# Altium project IRIS2_PCB_CPU.PrjPcb
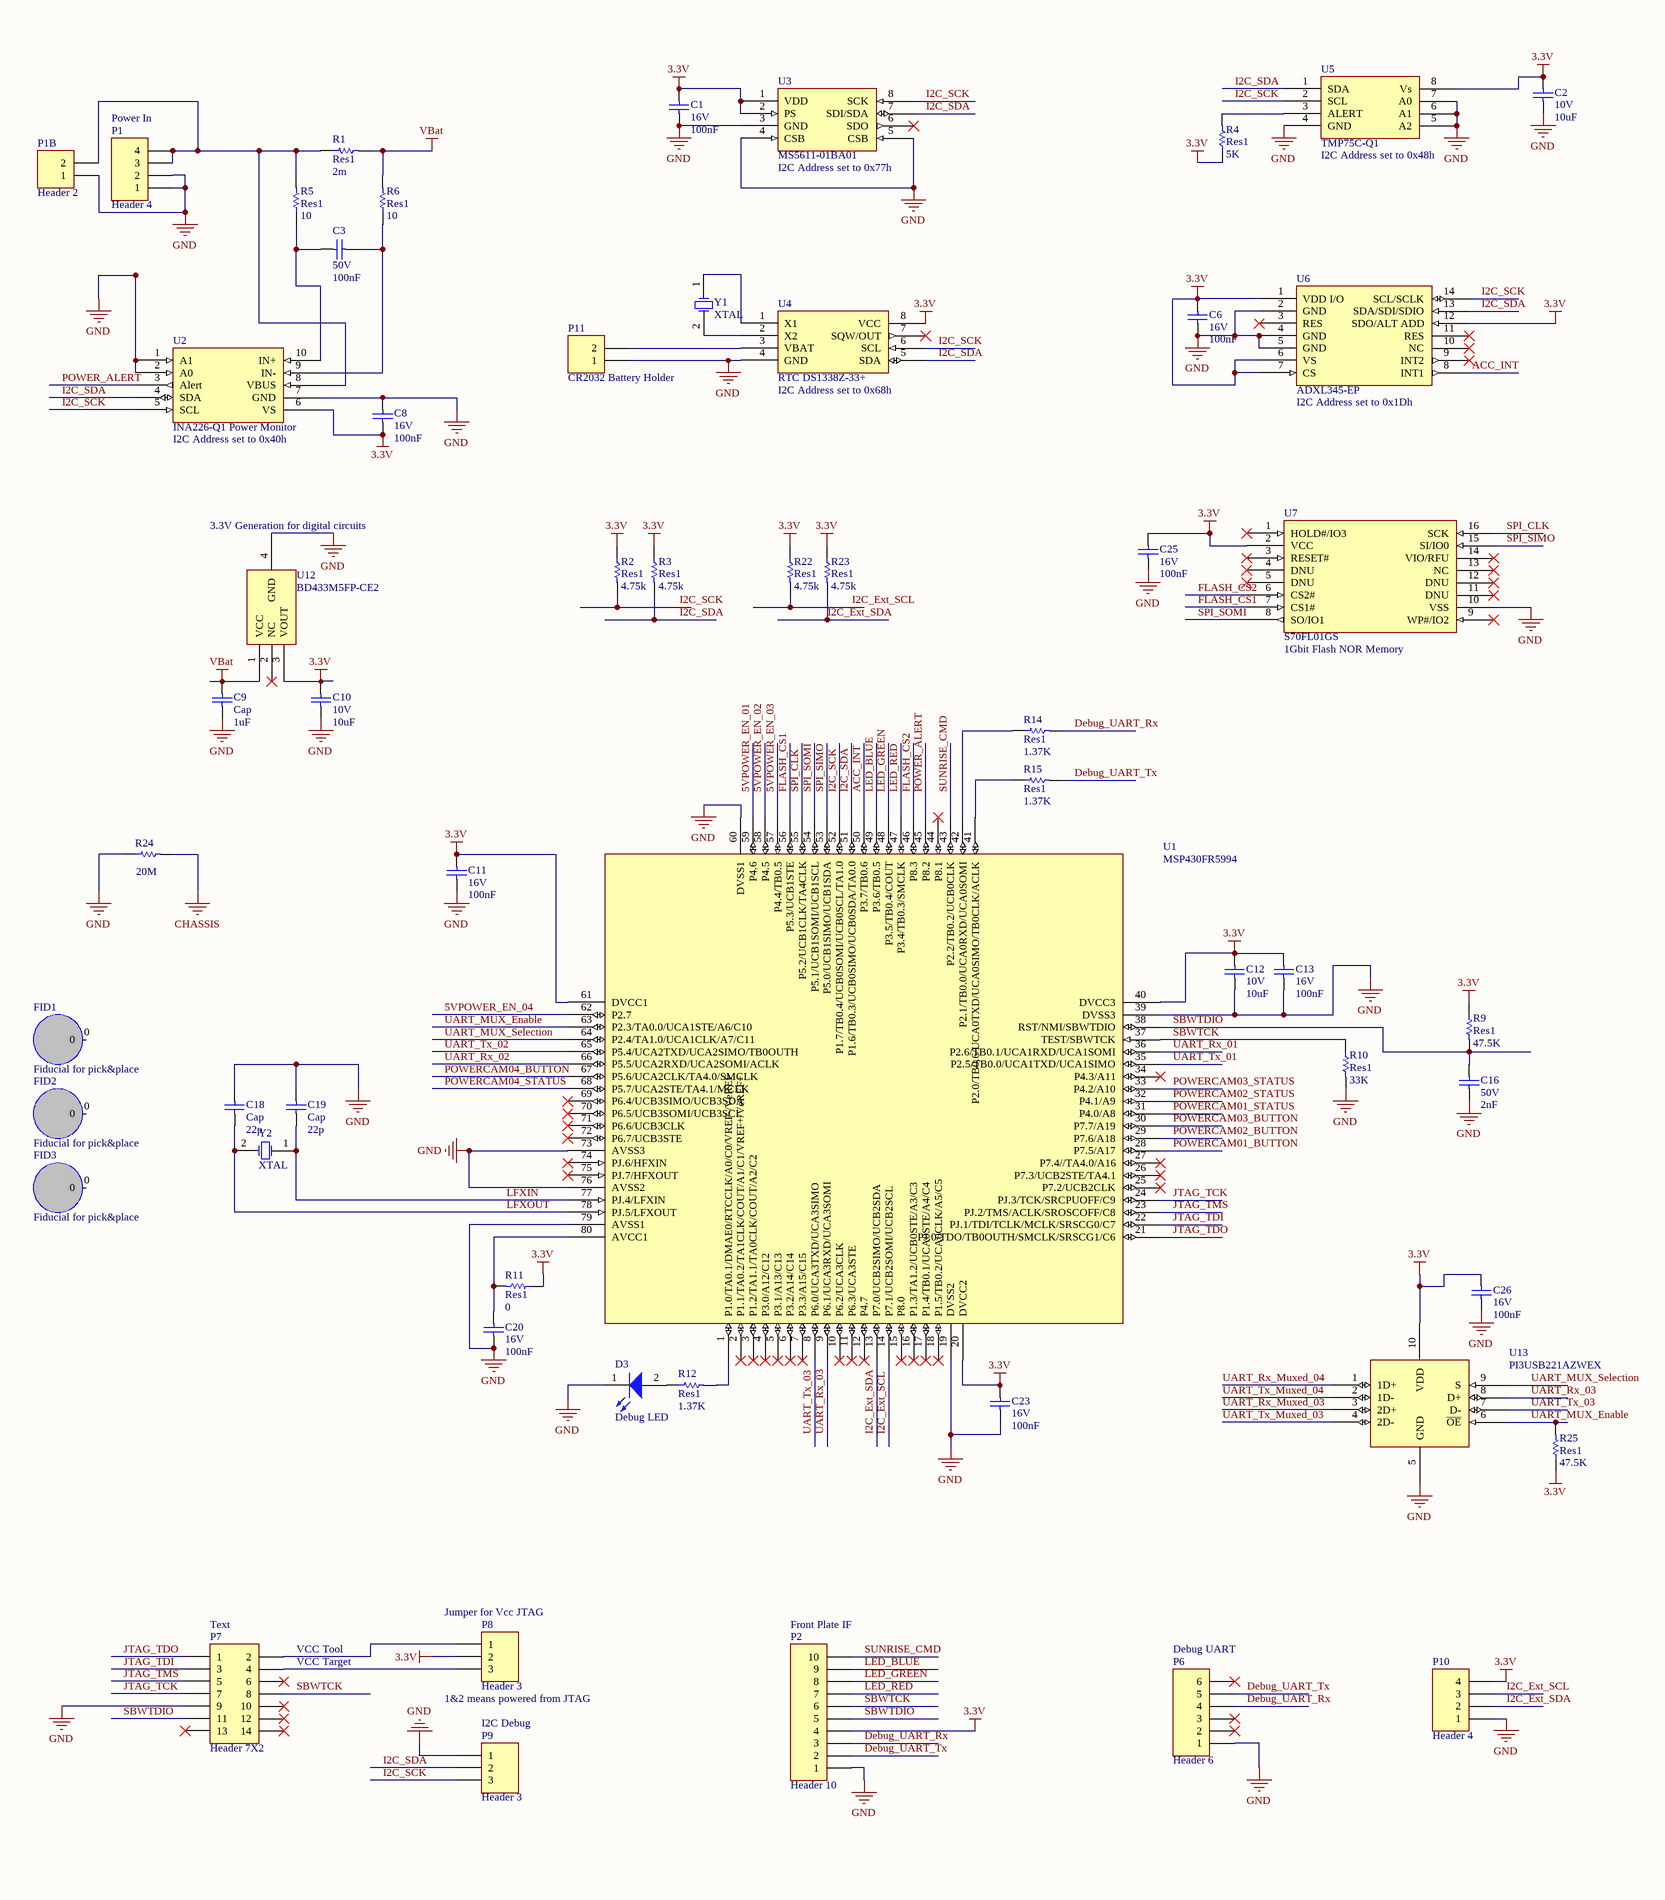
[diagram p0: IRIS2_PCB_CPU.SchDoc, left]
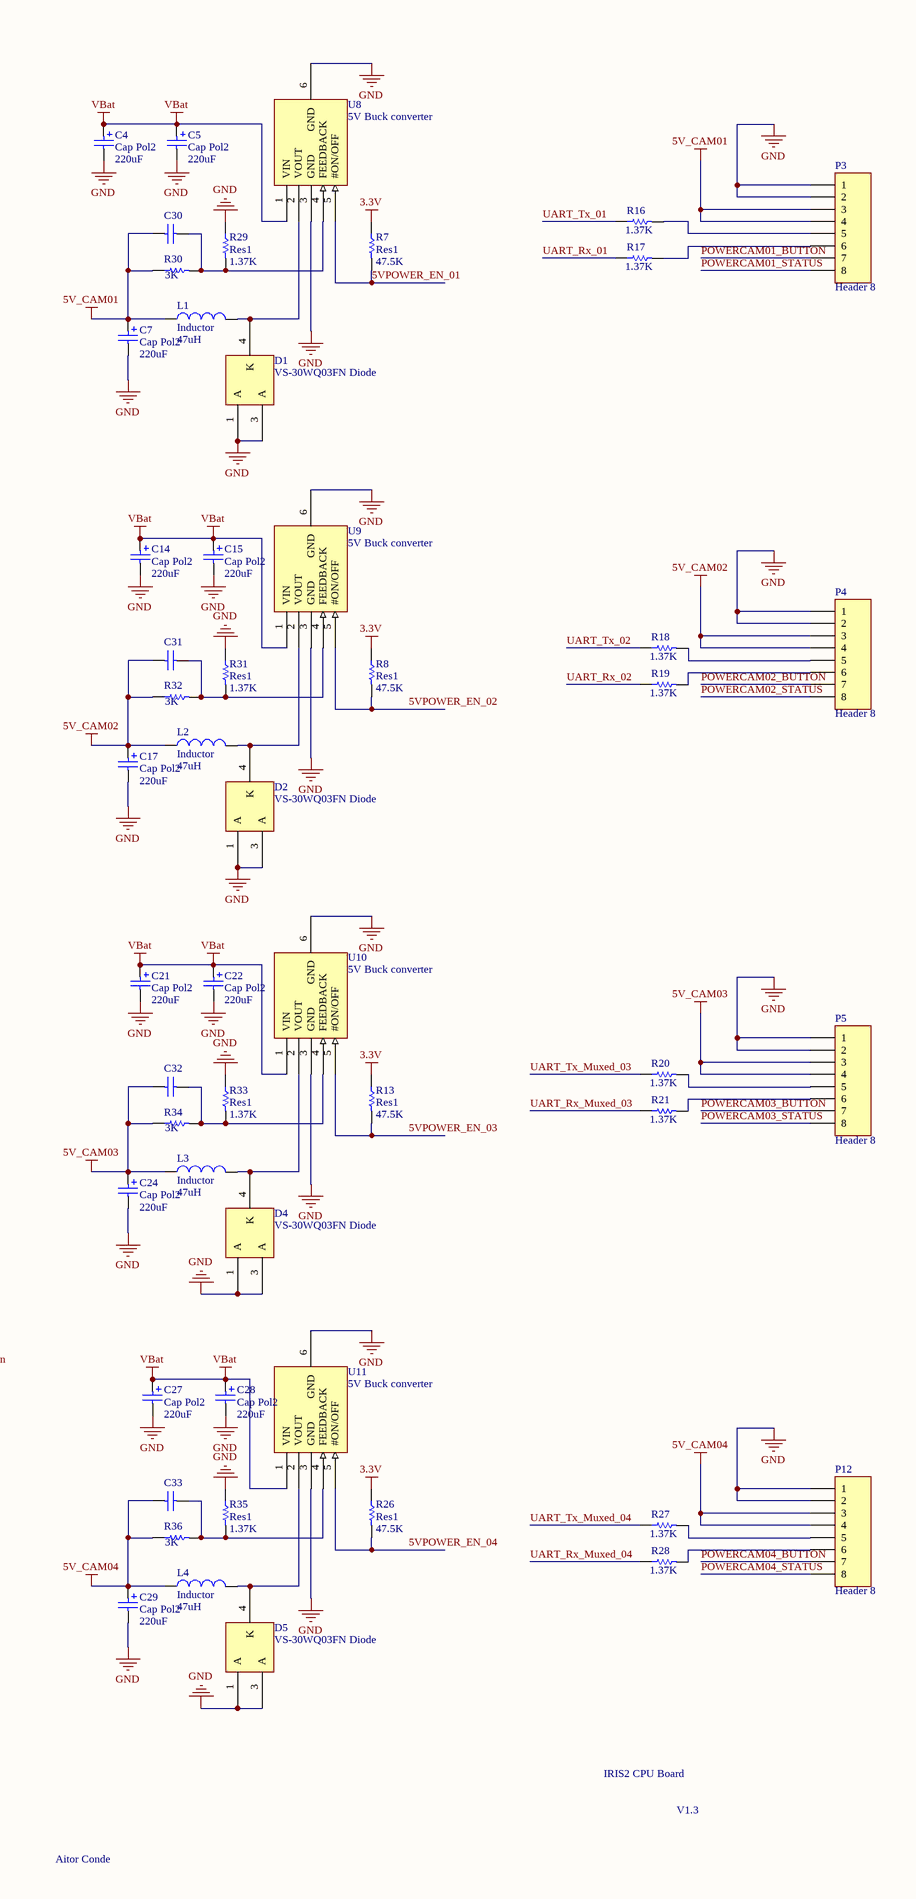
[diagram p1: IRIS2_PCB_CPU.SchDoc, right]
1 sheet, 109 parts. Net scope: global (net labels, ports and power ports of the same name join across sheets).
Board file: IRIS2_PCB_CPU.PcbDoc

## Sheet IRIS2_PCB_CPU.SchDoc
size A2; SheetNumber: 1; SheetTotal: 1

### Parts
C1  16V  value 100nF  [0402]
C2  10V  value 10uF  [1608[0603]]
C3  50V  value 100nF  [6-0805_L]
C4  Cap Pol2  value 220uF  [2917 [7343 Metric]]
C5  Cap Pol2  value 220uF  [2917 [7343 Metric]]
C6  16V  value 100nF  [0402]
C7  Cap Pol2  value 220uF  [2917 [7343 Metric]]
C8  16V  value 100nF  [0402]
C9  Cap  value 1uF  [1608[0603]]
C10  10V  value 10uF  [1608[0603]]
C11  16V  value 100nF  [0402]
C12  10V  value 10uF  [1608[0603]]
C13  16V  value 100nF  [0402]
C14  Cap Pol2  value 220uF  [2917 [7343 Metric]]
C15  Cap Pol2  value 220uF  [2917 [7343 Metric]]
C16  50V  value 2nF  [0402]
C17  Cap Pol2  value 220uF  [2917 [7343 Metric]]
C18  Cap  value 22p  [0402]
C19  Cap  value 22p  [0402]
C20  16V  value 100nF  [0402]
C21  Cap Pol2  value 220uF  [2917 [7343 Metric]]
C22  Cap Pol2  value 220uF  [2917 [7343 Metric]]
C23  16V  value 100nF  [0402]
C24  Cap Pol2  value 220uF  [2917 [7343 Metric]]
C25  16V  value 100nF  [0402]
C26  16V  value 100nF  [0402]
C27  Cap Pol2  value 220uF  [2917 [7343 Metric]]
C28  Cap Pol2  value 220uF  [2917 [7343 Metric]]
C29  Cap Pol2  value 220uF  [2917 [7343 Metric]]
C30  16V  [0402]  (value not drawn)
C31  16V  [0402]  (value not drawn)
C32  16V  [0402]  (value not drawn)
C33  16V  [0402]  (value not drawn)
D1  VS-30WQ03FN Diode  [VS-30WQ03FN]
D2  VS-30WQ03FN Diode  [VS-30WQ03FN]
D3  Debug LED  [0402-A]
D4  VS-30WQ03FN Diode  [VS-30WQ03FN]
D5  VS-30WQ03FN Diode  [VS-30WQ03FN]
FID1  Fiducial for pick&place  [FiducialPoint]
FID2  Fiducial for pick&place  [FiducialPoint]
FID3  Fiducial for pick&place  [FiducialPoint]
L1  Inductor  value 47uH  [DO5022P-473MLB]
L2  Inductor  value 47uH  [DO5022P-473MLB]
L3  Inductor  value 47uH  [DO5022P-473MLB]
L4  Inductor  value 47uH  [DO5022P-473MLB]
P1  Header 4  [53047-0410]
P1B  Header 2  [HDR1X2]
P2  Header 10  [530471010]
P3  Header 8  [0530470810]
P4  Header 8  [0530470810]
P5  Header 8  [0530470810]
P6  Header 6  [HDR1X6]
P7  Header 7X2  [HDR2X7]
P8  Header 3  [HDR1X3]
P9  Header 3  [HDR1X3]
P10  Header 4  [53047-0410]
P11  CR2032 Battery Holder  [SMTU2032-LF]
P12  Header 8  [0530470810]
R1  Res1  value 2m  [INDC3216]
R2  Res1  value 4.75k  [0402]
R3  Res1  value 4.75k  [0402]
R4  Res1  value 5K  [0402]
R5  Res1  value 10  [0402]
R6  Res1  value 10  [0402]
R7  Res1  value 47.5K  [0402]
R8  Res1  value 47.5K  [0402]
R9  Res1  value 47.5K  [0402]
R10  Res1  value 33K  [0402]
R11  Res1  value 0  [J1-0603]
R12  Res1  value 1.37K  [0402]
R13  Res1  value 47.5K  [0402]
R14  Res1  value 1.37K  [0402]
R15  Res1  value 1.37K  [0402]
R16  value 1.37K  [0402]  (hidden comment: Res1)
R17  value 1.37K  [0402]  (hidden comment: Res1)
R18  value 1.37K  [0402]  (hidden comment: Res1)
R19  value 1.37K  [0402]  (hidden comment: Res1)
R20  value 1.37K  [0402]  (hidden comment: Res1)
R21  value 1.37K  [0402]  (hidden comment: Res1)
R22  Res1  value 4.75k  [0402]
R23  Res1  value 4.75k  [0402]
R24  value 20M  [6-0805_N]  (hidden comment: Res1)
R25  Res1  value 47.5K  [0402]
R26  Res1  value 47.5K  [0402]
R27  value 1.37K  [0402]  (hidden comment: Res1)
R28  value 1.37K  [0402]  (hidden comment: Res1)
R29  Res1  value 1.37K  [0402]
R30  value 3K  [0402]  (hidden comment: Res1)
R31  Res1  value 1.37K  [0402]
R32  value 3K  [0402]  (hidden comment: Res1)
R33  Res1  value 1.37K  [0402]
R34  value 3K  [0402]  (hidden comment: Res1)
R35  Res1  value 1.37K  [0402]
R36  value 3K  [0402]  (hidden comment: Res1)
U1  MSP430FR5994  [MSP430FR59941PN]
U2  INA226-Q1 Power Monitor  [INA226-Q1]
U3  MS5611-01BA01  [MS5611-01BA01]
U4  RTC DS1338Z-33+  [DS1338Z-33+]
U5  TMP75C-Q1  [TMP75C-Q1]
U6  ADXL345-EP  [ADXL345-EP]
U7  S70FL01GS  [SPIFlash_S70FL01GSAGMFV010]
U8  5V Buck converter  [DPAK170P1435X457-6N]
U9  5V Buck converter  [DPAK170P1435X457-6N]
U10  5V Buck converter  [DPAK170P1435X457-6N]
U11  5V Buck converter  [DPAK170P1435X457-6N]
U12  BD433M5FP-CE2  [BD433M5FP-CE2]
U13  PI3USB221AZWEX  [PI3USB221AZWEX]
Y1  XTAL  [XTAL_ECS-.327-9-34R-TR]
Y2  XTAL  [XTAL_ECS-.327-9-34R-TR]

### Nets
3.3V: C1.1 C2.1 C6.1 C8.2 C10.1 C11.1 C12.1 C13.1 C23.1 C25.1 C26.1 P2.4 P8.2 P10.4 R2.1 R3.1 R4.1 R7.1 R8.1 R9.1 R11.1 R13.1 R22.1 R23.1 R25.1 R26.1 U1.20(DVCC2) U1.40(DVCC3) U1.61(DVCC1) U2.6(VS) U3.1(VDD) U3.2(PS) U4.8(VCC) U5.8(Vs) U6.1(VDD_I/O) U6.6(VS) U6.7(CS) U6.12(SDO/ALT_ADD) U7.2(VCC) U12.3(VOUT) U13.10(VDD)
5V_CAM01: C7.1 C30.1 L1.1 P3.3 P3.4 R30.1
5V_CAM02: C17.1 C31.1 L2.1 P4.3 P4.4 R32.1
5V_CAM03: C24.1 C32.1 L3.1 P5.3 P5.4 R34.1
5V_CAM04: C29.1 C33.1 L4.1 P12.3 P12.4 R36.1
CHASSIS: R24.2
GND: C1.2 C2.2 C4.2 C5.2 C6.2 C7.2 C8.1 C9.1 C10.2 C11.2 C12.2 C13.2 C14.2 C15.2 C16.2 C17.2 C18.2 C19.2 C20.2 C21.2 C22.2 C23.2 C24.2 C25.2 C26.2 C27.2 C28.2 C29.2 D1.1(A) D1.3(A) D2.1(A) D2.3(A) D3.1(K) D4.1(A) D4.3(A) D5.1(A) D5.3(A) P1.1 P1.2 P1B.1 P2.1 P3.1 P3.2 P4.1 P4.2 P5.1 P5.2 P6.1 P7.9 P9.1 P10.1 P11.1 P12.1 P12.2 R10.2 R24.1 R29.1 R31.1 R33.1 R35.1 U1.19(DVSS2) U1.39(DVSS3) U1.60(DVSS1) U1.73(AVSS3) U1.76(AVSS2) U1.79(AVSS1) U2.1(A1) U2.2(A0) U2.7(GND) U3.3(GND) U3.4(CSB) U3.5(CSB) U4.4(GND) U5.4(GND) U5.5(A2) U5.6(A1) U5.7(A0) U6.2(GND) U6.4(GND) U6.5(GND) U7.10(VSS) U8.3(GND) U8.6(GND) U9.3(GND) U9.6(GND) U10.3(GND) U10.6(GND) U11.3(GND) U11.6(GND) U12.4(GND) U13.5(GND)
VBat: C4.1 C5.1 C9.2 C14.1 C15.1 C21.1 C22.1 C27.1 C28.1 R1.2 R6.2 U8.1(VIN) U9.1(VIN) U10.1(VIN) U11.1(VIN) U12.1(VCC)
5VPOWER_EN_01: R7.2 U1.59(P4.6) U8.5(#ON/OFF)
5VPOWER_EN_02: R8.2 U1.58(P4.5) U9.5(#ON/OFF)
5VPOWER_EN_03: R13.2 U1.57(P4.4/TB0.5) U10.5(#ON/OFF)
5VPOWER_EN_04: R26.2 U1.62(P2.7) U11.5(#ON/OFF)
ACC_INT: U1.50(P3.7/TB0.6) U6.8(INT1)
Debug_UART_Rx: P2.3 P6.4 R14.2
Debug_UART_Tx: P2.2 P6.5 R15.2
FLASH_CS1: U1.56(P5.3/UCB1STE) U7.7(CS1#)
FLASH_CS2: U1.46(P8.3) U7.6(CS2#)
I2C_Ext_SCL: P10.3 R22.2 U1.14(P7.1/UCB2SOMI/UCB2SCL)
I2C_Ext_SDA: P10.2 R23.2 U1.13(P7.0/UCB2SIMO/UCB2SDA)
I2C_SCK: P9.3 R2.2 U1.52(P1.7/TB0.4/UCB0SOMI/UCB0SCL/TA1.0) U2.5(SCL) U3.8(SCK) U4.6(SCL) U5.2(SCL) U6.14(SCL/SCLK)
I2C_SDA: P9.2 R3.2 U1.51(P1.6/TB0.3/UCB0SIMO/UCB0SDA/TA0.0) U2.4(SDA) U3.7(SDI/SDA) U4.5(SDA) U5.1(SDA) U6.13(SDA/SDI/SDIO)
JTAG_TCK: P7.7 U1.24(PJ.3/TCK/SRCPUOFF/C9)
JTAG_TDI: P7.3 U1.22(PJ.1/TDI/TCLK/MCLK/SRSCG0/C7)
JTAG_TDO: P7.1 U1.21(PJ.0/TDO/TB0OUTH/SMCLK/SRSCG1/C6)
JTAG_TMS: P7.5 U1.23(PJ.2/TMS/ACLK/SROSCOFF/C8)
LED_BLUE: P2.9 U1.49(P3.6/TB0.5)
LED_GREEN: P2.8 U1.48(P3.5/TB0.4/COUT)
LED_RED: P2.7 U1.47(P3.4/TB0.3/SMCLK)
LFXIN: C19.1 U1.77(PJ.4/LFXIN) Y2.1(OSC1)
LFXOUT: C18.1 U1.78(PJ.5/LFXOUT) Y2.2(OSC2)
POWER_ALERT: U1.45(P8.2) U2.3(Alert)
POWERCAM01_BUTTON: P3.7 U1.28(P7.5/A17)
POWERCAM01_STATUS: P3.8 U1.31(P4.0/A8)
POWERCAM02_BUTTON: P4.7 U1.29(P7.6/A18)
POWERCAM02_STATUS: P4.8 U1.32(P4.1/A9)
POWERCAM03_BUTTON: P5.7 U1.30(P7.7/A19)
POWERCAM03_STATUS: P5.8 U1.33(P4.2/A10)
POWERCAM04_BUTTON: P12.7 U1.67(P5.6/UCA2CLK/TA4.0/SMCLK)
POWERCAM04_STATUS: P12.8 U1.68(P5.7/UCA2STE/TA4.1/MCLK)
SBWTCK: P2.6 P7.8 R10.1 U1.37(TEST/SBWTCK)
SBWTDIO: C16.1 P2.5 P7.11 R9.2 U1.38(RST/NMI/SBWTDIO)
SPI_CLK: U1.55(P5.2/UCB1CLK/TA4CLK) U7.16(SCK)
SPI_SIMO: U1.53(P5.0/UCB1SIMO/UCB1SDA) U7.15(SI/IO0)
SPI_SOMI: U1.54(P5.1/UCB1SOMI/UCB1SCL) U7.8(SO/IO1)
SUNRISE_CMD: P2.10 U1.43(P2.2/TB0.2/UCB0CLK)
UART_MUX_Enable: R25.2 U1.63(P2.3/TA0.0/UCA1STE/A6/C10) U13.6(~{OE})
UART_MUX_Selection: U1.64(P2.4/TA1.0/UCA1CLK/A7/C11) U13.9(S)
UART_Rx_01: R17.1 U1.36(P2.6/TB0.1/UCA1RXD/UCA1SOMI)
UART_Rx_02: R19.1 U1.66(P5.5/UCA2RXD/UCA2SOMI/ACLK)
UART_Rx_03: U1.9(P6.1/UCA3RXD/UCA3SOMI) U13.8(D+)
UART_Rx_Muxed_03: R21.1 U13.3(2D+)
UART_Rx_Muxed_04: R28.1 U13.1(1D+)
UART_Tx_01: R16.1 U1.35(P2.5/TB0.0/UCA1TXD/UCA1SIMO)
UART_Tx_02: R18.1 U1.65(P5.4/UCA2TXD/UCA2SIMO/TB0OUTH)
UART_Tx_03: U1.8(P6.0/UCA3TXD/UCA3SIMO) U13.7(D-)
UART_Tx_Muxed_03: R20.1 U13.4(2D-)
UART_Tx_Muxed_04: R27.1 U13.2(1D-)
NetC3_1: C3.1 R5.1 U2.10(IN+)
NetC3_2: C3.2 R6.1 U2.9(IN-)
NetC20_1: C20.1 R11.2 U1.80(AVCC1)
NetC30_2: C30.2 R29.2 R30.2 U8.4(FEEDBACK)
NetC31_2: C31.2 R31.2 R32.2 U9.4(FEEDBACK)
NetC32_2: C32.2 R33.2 R34.2 U10.4(FEEDBACK)
NetC33_2: C33.2 R35.2 R36.2 U11.4(FEEDBACK)
NetD1_4: D1.4(K) L1.2 U8.2(VOUT)
NetD2_4: D2.4(K) L2.2 U9.2(VOUT)
NetD3_2: D3.2(A) R12.1
NetD4_4: D4.4(K) L3.2 U10.2(VOUT)
NetD5_4: D5.4(K) L4.2 U11.2(VOUT)
NetP1_3: P1.3 P1.4 P1B.2 R1.1 R5.2 U2.8(VBUS)
NetP3_5: P3.5 R16.2
NetP3_6: P3.6 R17.2
NetP4_5: P4.5 R18.2
NetP4_6: P4.6 R19.2
NetP5_5: P5.5 R20.2
NetP5_6: P5.6 R21.2
NetP7_2: P7.2 P8.1
NetP7_4: P7.4 P8.3
NetP11_2: P11.2 U4.3(VBAT)
NetP12_5: P12.5 R27.2
NetP12_6: P12.6 R28.2
NetR4_2: R4.2 U5.3(ALERT)
NetR12_2: R12.2 U1.1(P1.0/TA0.1/DMAE0/RTCCLK/A0/C0/VREF-/VeREF)
NetR14_1: R14.1 U1.42(P2.1/TB0.0/UCA0RXD/UCA0SOMI)
NetR15_1: R15.1 U1.41(P2.0/TB0.6/UCA0TXD/UCA0SIMO/TB0CLK/ACLK)
NetU4_1: U4.1(X1) Y1.1(OSC1)
NetU4_2: U4.2(X2) Y1.2(OSC2)

Not connected (* = marked no-connect by the designer): FID1 0; FID2 0; FID3 0; P6 2* 3* 6*; P7 6* 10* 12* 13* 14*; U1 2(P1.1/TA0.2/TA1CLK/COUT/A1/C1/VREF+/VeREF+)* 3(P1.2/TA1.1/TA0CLK/COUT/A2/C2)* 4(P3.0/A12/C12)* 5(P3.1/A13/C13)* 6(P3.2/A14/C14)* 7(P3.3/A15/C15)* 10(P6.2/UCA3CLK)* 11(P6.3/UCA3STE)* 12(P4.7)* 15(P8.0)* 16(P1.3/TA1.2/UCB0STE/A3/C3)* 17(P1.4/TB0.1/UCA0STE/A4/C4)* 18(P1.5/TB0.2/UCA0CLK/A5/C5)* 25(P7.2/UCB2CLK)* 26(P7.3/UCB2STE/TA4.1)* 27(P7.4//TA4.0/A16)* 34(P4.3/A11)* 44(P8.1)* 69(P6.4/UCB3SIMO/UCB3SDA)* 70(P6.5/UCB3SOMI/UCB3SCL)* 71(P6.6/UCB3CLK)* 72(P6.7/UCB3STE)* 74(PJ.6/HFXIN)* 75(PJ.7/HFXOUT)*; U3 6(SDO)*; U4 7(SQW/OUT)*; U6 3(RES)* 9(INT2)* 10(NC)* 11(RES)*; U7 1(HOLD#/IO3)* 3(RESET#)* 4(DNU)* 5(DNU)* 9(WP#/IO2)* 11(DNU)* 12(DNU)* 13(NC)* 14(VIO/RFU)*; U12 2(NC)*

### Notes on the sheet
- (near P1) Power In
- (near U3) I2C Address set to 0x77h
- (near U5) I2C Address set to 0x48h
- (near U4) I2C Address set to 0x68h
- (near U2) I2C Address set to 0x40h
- (near U6) I2C Address set to 0x1Dh
- (near U12) 3.3V Generation for digital circuits
- (near U7) 1Gbit Flash NOR Memory
- (near P7) Text
- (near P8) Jumper for Vcc JTAG
- (near P2) Front Plate IF
- (near P7) VCC Tool
- (near P7) VCC Target
- (near P6) Debug UART
- (near P8) 1&2 means powered from JTAG
- (near P9) I2C Debug
- IRIS2 CPU Board
- V1.3
- Aitor Conde

### Library data of the parts
C1 C6 C8 C11 C13 C20 C23 C25 C26 = Cap: Capacitor; Manufacturer: Murata; Reference: GCM155R71C104KA55D; Published: 8-Jun-2000; LatestRevisionDate: 17-Jul-2002; LatestRevisionNote: Re-released for DXP Platform.; PackageReference: RAD-0.3; Publisher: Altium Limited; PackageDescription: Radial Cap, Thru-Hole; 2 Leads; 0.3 in Pin Spacing
C2 C10 C12 = Cap: Capacitor; Manufacturer: Murata; Reference: GRT188R61A106ME13D; Published: 8-Jun-2000; LatestRevisionDate: 17-Jul-2002; LatestRevisionNote: Re-released for DXP Platform.; PackageReference: RAD-0.3; Publisher: Altium Limited; PackageDescription: Radial Cap, Thru-Hole; 2 Leads; 0.3 in Pin Spacing
C3 = Cap: Capacitor; Manufacturer: Murata; Reference: GCJ21BR71H104KA01L; Published: 8-Jun-2000; LatestRevisionDate: 17-Jul-2002; LatestRevisionNote: Re-released for DXP Platform.; PackageReference: RAD-0.3; Publisher: Altium Limited; PackageDescription: Radial Cap, Thru-Hole; 2 Leads; 0.3 in Pin Spacing
C4 C5 C7 C14 C15 C17 C21 C22 C24 C27-C29 = Cap Pol2: Polarized Capacitor (Axial); Manufacturer: Kemet; Reference: T491D227M016AT
C9 = Cap: Capacitor; Manufacturer: Murata; Reference: GRT188R61H105ME13D; LatestRevisionDate: 17-Jul-2002; LatestRevisionNote: Re-released for DXP Platform.; Publisher: Altium Limited; PackageDescription: Radial Cap, Thru-Hole; 2 Leads; 0.3 in Pin Spacing
C16 = Cap: Capacitor; Manufacturer: Murata; Reference: GRM1557U1A202JA01D; Published: 8-Jun-2000; LatestRevisionDate: 17-Jul-2002; LatestRevisionNote: Re-released for DXP Platform.; PackageReference: RAD-0.3; Publisher: Altium Limited; PackageDescription: Radial Cap, Thru-Hole; 2 Leads; 0.3 in Pin Spacing
C18 C19 = Cap: Capacitor; Manufacturer: Murata; Reference: GCQ1555C1H220GB01D; LatestRevisionDate: 17-Jul-2002; LatestRevisionNote: Re-released for DXP Platform.; Publisher: Altium Limited; PackageDescription: Radial Cap, Thru-Hole; 2 Leads; 0.3 in Pin Spacing
C30-C33 = Cap: Capacitor; Value: 100nF; Reference: DNP; Published: 8-Jun-2000; LatestRevisionDate: 17-Jul-2002; LatestRevisionNote: Re-released for DXP Platform.; PackageReference: RAD-0.3; Publisher: Altium Limited; PackageDescription: Radial Cap, Thru-Hole; 2 Leads; 0.3 in Pin Spacing
D1 D2 D4 D5 = VS-30WQ03FN: Manufacturer: Vishay; Reference: VS-30WQ03FN
D3 = LED2: Typical RED, GREEN, YELLOW, AMBER GaAs LED; Manufacturer: ROHM Semiconductor; Reference: SMLP13EC8TT86; Published: 8-Jun-2000; LatestRevisionDate: 17-Jul-2002; LatestRevisionNote: Re-released for DXP Platform.; PackageVersion: Feb-2002; PackageReference: 3.2X1.6X1.1; Publisher: Altium Limited; PackageDescription: SM LED; 2 Flat Leads
FID1-FID3 = Fiducial
L1-L4 = Inductor: Manufacturer: Coilcraft; Reference: DO5022P-473MLB
P1 P10 = Header 4: Header, 4-Pin; Manufacturer: Molex; Reference: 0530470410; LatestRevisionDate: 17-Jul-2002; LatestRevisionNote: Re-released for DXP Platform.; Publisher: Altium Limited
P1B = Header 2: Header, 2-Pin; LatestRevisionDate: 17-Jul-2002; LatestRevisionNote: Re-released for DXP Platform.; Publisher: Altium Limited
P2 = Header 10: Header, 10-Pin; Manufacturer: Molex; Reference: 530471010
P3-P5 P12 = Header 8: Header, 8-Pin; Manufacturer: Molex; Reference: 0530470810
P6 = Header 6: Header, 6-Pin; LatestRevisionDate: 17-Jul-2002; LatestRevisionNote: Re-released for DXP Platform.; Publisher: Altium Limited
P7 = Header 7X2: Header, 7-Pin, Dual row; LatestRevisionDate: 17-Jul-2002; LatestRevisionNote: Re-released for DXP Platform.; Publisher: Altium Limited
P8 P9 = Header 3: Header, 3-Pin; LatestRevisionDate: 17-Jul-2002; LatestRevisionNote: Re-released for DXP Platform.; Publisher: Altium Limited
P11 = Header 2: Manufacturer: Renata; Reference: SMTU2032-LF
R1 = Res1: Resistor; Manufacturer: ROHM Semiconductor; Spplier Part Number: 755-PMR18EZPFV2L00; Reference: PMR18EZPFV2L00; Published: 8-Jun-2000; LatestRevisionDate: 17-Jul-2002; LatestRevisionNote: Re-released for DXP Platform.; PackageReference: AXIAL-0.3; Publisher: Altium Limited; PackageDescription: Axial Device, Thru-Hole; 2 Leads; 0.3 in Pin Spacing; Supplier: Mouser
R2 R3 R22 R23 = Res1: Resistor; Manufacturer: Panasonic; Reference: ERJ-2RKF4751X; LatestRevisionDate: 17-Jul-2002; LatestRevisionNote: Re-released for DXP Platform.; PackageReference: AXIAL-0.3; Publisher: Altium Limited; PackageDescription: Axial Device, Thru-Hole; 2 Leads; 0.3 in Pin Spacing; Supplier 1: Mouser; Supplier Part Number 1: 667-ERJ-2RKF1002X
R4 = Res1: Resistor; Manufacturer: Yageo; Component Description: RES 47.5K OHM 1/10W 1% 0603 SMD; Reference: RT0402DRE075K1L; Published: 8-Jun-2000; LatestRevisionDate: 17-Jul-2002; LatestRevisionNote: Re-released for DXP Platform.; PackageReference: AXIAL-0.3; Publisher: Altium Limited
R5 R6 = Res1: Resistor; Manufacturer: Panasonic; Reference: ERJ2RKD10R0X; LatestRevisionDate: 17-Jul-2002; LatestRevisionNote: Re-released for DXP Platform.; PackageReference: AXIAL-0.3; Publisher: Altium Limited; PackageDescription: Axial Device, Thru-Hole; 2 Leads; 0.3 in Pin Spacing; Supplier 1: Mouser; Supplier Part Number 1: 667-ERJ-2RKD10R0X
R7-R9 R13 R25 R26 = Res1: Resistor; Manufacturer: Panasonic; Component Description: RES 47.5K OHM 1/10W 1% 0603 SMD; Reference: ERJ-2RKF4752X; Published: 8-Jun-2000; LatestRevisionDate: 17-Jul-2002; LatestRevisionNote: Re-released for DXP Platform.; PackageReference: AXIAL-0.3
R10 = Res1: Resistor; Manufacturer: Panasonic; Component Description: RES 47.5K OHM 1/10W 1% 0603 SMD; Reference: ERJ-2GEJ333X; Published: 8-Jun-2000; LatestRevisionDate: 17-Jul-2002; LatestRevisionNote: Re-released for DXP Platform.; PackageReference: AXIAL-0.3; Publisher: Altium Limited
R11 = Res1: Resistor; Manufacturer: Panasonic; Reference: ERJ-3GEY0R00V; Published: 8-Jun-2000; LatestRevisionDate: 17-Jul-2002; LatestRevisionNote: Re-released for DXP Platform.; PackageReference: AXIAL-0.3; Publisher: Altium Limited; PackageDescription: Axial Device, Thru-Hole; 2 Leads; 0.3 in Pin Spacing
R12 R14-R21 R27-R29 R31 R33 R35 = Res1: Resistor; Manufacturer: Panasonic; Reference: ERJ-2RKF1371X; Published: 8-Jun-2000; LatestRevisionDate: 17-Jul-2002; LatestRevisionNote: Re-released for DXP Platform.; Publisher: Altium Limited; PackageDescription: Axial Device, Thru-Hole; 2 Leads; 0.3 in Pin Spacing; Supplier 1: Mouser; Supplier Part Number 1: 667-ERJ-2RKF1371X
R24 = Res1: Resistor; Manufacturer: KOA; Reference: RK73B2ATTD206J; LatestRevisionDate: 17-Jul-2002; LatestRevisionNote: Re-released for DXP Platform.; PackageReference: AXIAL-0.3; Publisher: Altium Limited; PackageDescription: Axial Device, Thru-Hole; 2 Leads; 0.3 in Pin Spacing; Supplier 1: Mouser; Supplier Part Number 1: 667-ERJ-2RKF1002X
R30 R32 R34 R36 = Res1: Resistor; Manufacturer: Vishay; Reference: CRCW04023K00FKEDC; Published: 8-Jun-2000; LatestRevisionDate: 17-Jul-2002; LatestRevisionNote: Re-released for DXP Platform.; Publisher: Altium Limited; PackageDescription: Axial Device, Thru-Hole; 2 Leads; 0.3 in Pin Spacing; Supplier 1: Mouser; Supplier Part Number 1: 667-ERJ-2RKF1371X
U1 = MSP430FR5994: MSP430FR5994, 80 pin MSP430 FRAM; Manufacturer: Texas Instruments; Reference: MSP430FR5994IPNR
U2 = INA226-Q1: Texas Instruments INA226-Q1 I2C temperature sensor INA226AQDGSRQ1; Reference: INA226-Q1; Manufacturer: Texas Instruments
U3 = MS5611-01BA01: MS5611-01BA01 Barometric Pressure Sensor; Manufacturer: measurement specialties; Reference: MS561101BA03-50
U4 = DS1338Z-33+: RTC I2C DS1338Z-33+ SOIC-8; Manufacturer: Maxim Integrated; Reference: DS1338Z-33+
U5 = TMP75C-Q1: Manufacturer: Texas Instruments; Reference: TMP175AIDR
U6 = ADXL345-EP: ADXL345-EP I2C Accelerometer; Manufacturer: Analog Devices; Reference: ADXL345-EP
U7 = S70FL01GS: S70FL01GS SPI NOR Flash; Manufacturer: Cypress; Reference: S70FL01GSAGMFV010
U8-U11 = LM2596S-5.0/NOPB: LM2596S-5.0/NOPB 5V Buck converter; Manufacturer: Texas Instruments; Reference: LM2596S-ADJ/NOPB
U12 = BD433M5FP-CE2: BD433M5FP-CE2 / LDO 3.3V 500mV; Manufacturer: ROHM Semiconductor; Reference: BD433M5FP-CE2
U13 = PI3USB221AZWEX: PI3USB221AZWEX Multiplexer; Manufacturer: Diodes Incorporated; Reference: PI3USB221AZWEX
Y1 Y2 = XTAL: Crystal Oscillator; Manufacturer: ECS; Reference: ECS-.327-9-34R-TR